# Altium schematic sheet reefpi_pico_pi.SchDoc: reef-pi Pico - Pi Interface
size A4; DocumentNumber: 2; Revision: B; SheetNumber: 2; SheetTotal: 8
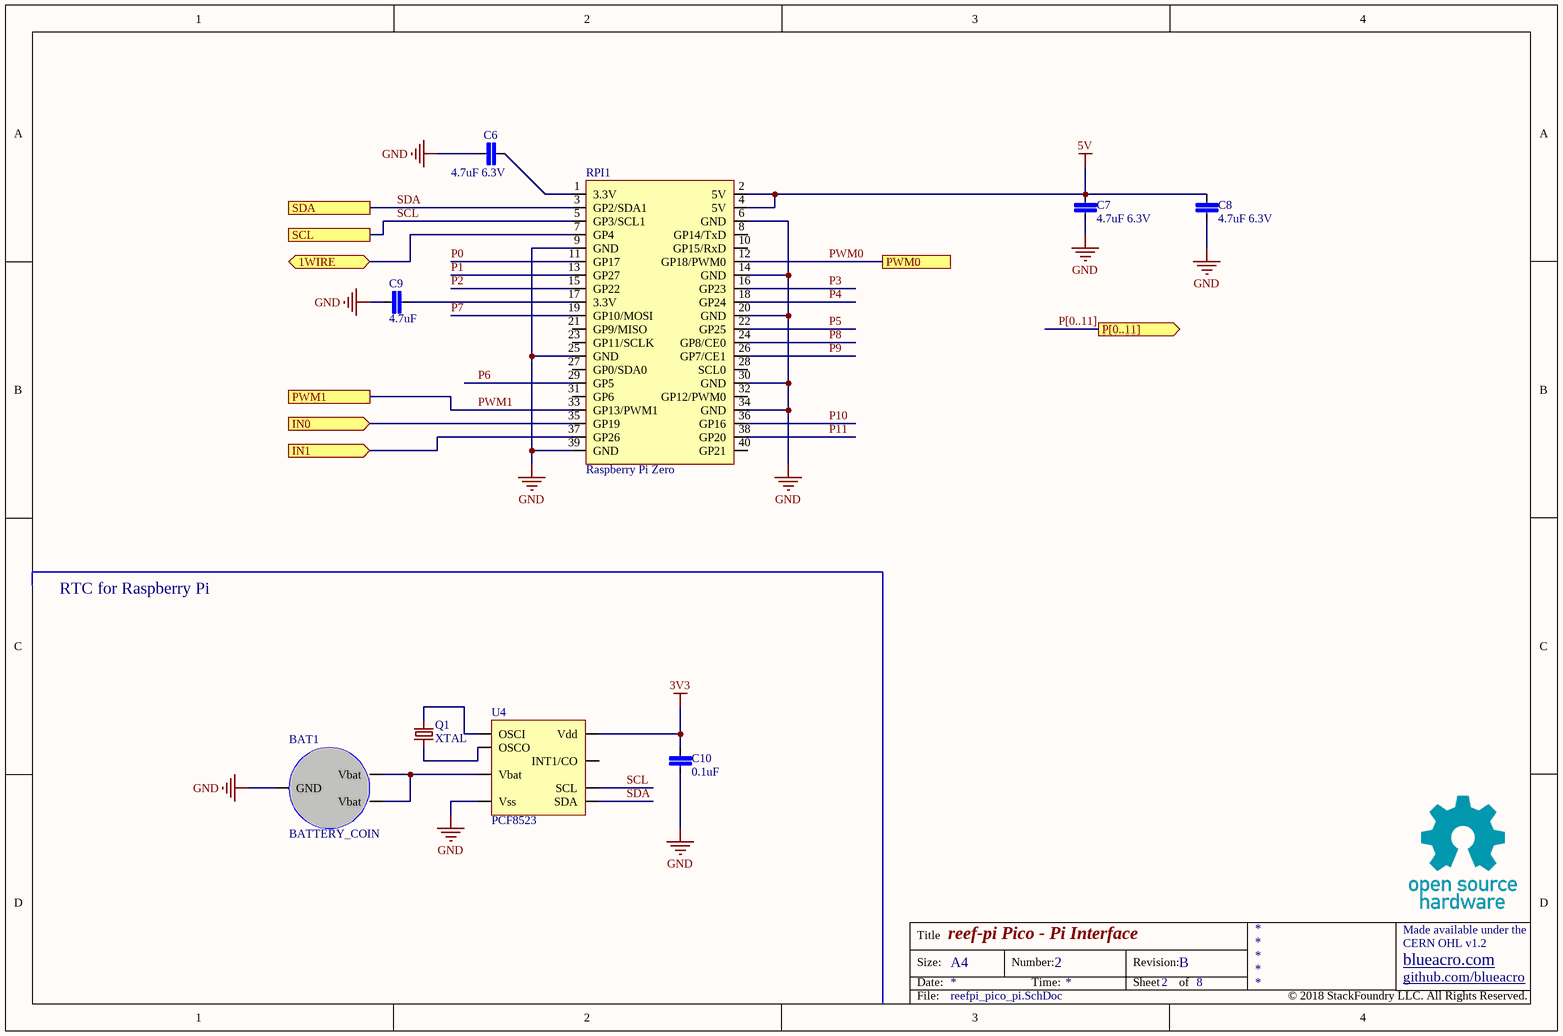
[diagram p0: reefpi_pico_pi.SchDoc]

## Parts
BAT1  BATTERY_COIN  [BK-885-1216]
C6  4.7uF 6.3V  [C0603]
C7  4.7uF 6.3V  [C0603]
C8  4.7uF 6.3V  [C0603]
C9  4.7uF  [C0603]
C10  0.1uF  [C0603]
Q1  XTAL  [CRYSTAL-32KHZ-SMD]
RPI1  Raspberry Pi Zero  [RPI_ZERO_W - FD]
U4  PCF8523  [SO-8]

## Ports
1WIRE (bidir), IN0 (in), IN1 (in), P[0..11] (out), PWM0, PWM1, SCL, SDA

## Nets
3V3: C10.1 U4.8(Vdd)
5V: C7.1 C8.1 RPI1.2(5V) RPI1.4(5V)
GND: BAT1.GND C6.1 C7.2 C8.2 C9.1 C10.2 RPI1.6(GND) RPI1.9(GND) RPI1.14(GND) RPI1.20(GND) RPI1.25(GND) RPI1.30(GND) RPI1.34(GND) RPI1.39(GND) U4.4(Vss)
1WIRE: RPI1.7(GP4) ; port 1WIRE
IN0: RPI1.35(GP19) ; port IN0
IN1: RPI1.37(GP26) ; port IN1
P0: RPI1.11(GP17)
P1: RPI1.13(GP27)
P2: RPI1.15(GP22)
P3: RPI1.16(GP23)
P4: RPI1.18(GP24)
P5: RPI1.22(GP25)
P6: RPI1.29(GP5)
P7: RPI1.19(GP10/MOSI)
P8: RPI1.24(GP8/CE0)
P9: RPI1.26(GP7/CE1)
P10: RPI1.36(GP16)
P11: RPI1.38(GP20)
PWM0: RPI1.12(GP18/PWM0) ; port PWM0
PWM1: RPI1.33(GP13/PWM1) ; port PWM1
SCL: RPI1.5(GP3/SCL1) U4.6(SCL) ; port SCL
SDA: RPI1.3(GP2/SDA1) U4.5(SDA) ; port SDA
NetBAT1_VBAT1: BAT1.VBAT1(Vbat) BAT1.VBAT2(Vbat) U4.3(Vbat)
NetC6_2: C6.2 RPI1.1(3.3V)
NetC9_2: C9.2 RPI1.17(3.3V)
NetQ1_X1: Q1.X1 U4.2(OSCO)
NetQ1_X2: Q1.X2 U4.1(OSCI)

Not connected (* = marked no-connect by the designer): RPI1 8(GP14/TxD) 10(GP15/RxD) 21(GP9/MISO) 23(GP11/SCLK) 27(GP0/SDA0) 28(SCL0) 31(GP6) 32(GP12/PWM0) 40(GP21); U4 7(INT1/CO)

## Buses and harness runs
bus P[0..11] = port P[0..11]

## Notes on the sheet
- RTC for Raspberry Pi
- Title
- Size:
- Date:
- A4
- Number:
- Time:
- Revision:
- Sheet
- of
- github.com/blueacro
- blueacro.com
- CERN OHL v1.2
- Made available under the
- File:
- © 2018 StackFoundry LLC. All Rights Reserved.

## Library data of the parts
C6-C10 = C-EU
Q1 = CRYSTAL32-SMD
RPI1 = RPI Zero